# EAGLE design 7-Segment Anzeige (EAGLE 4.15)
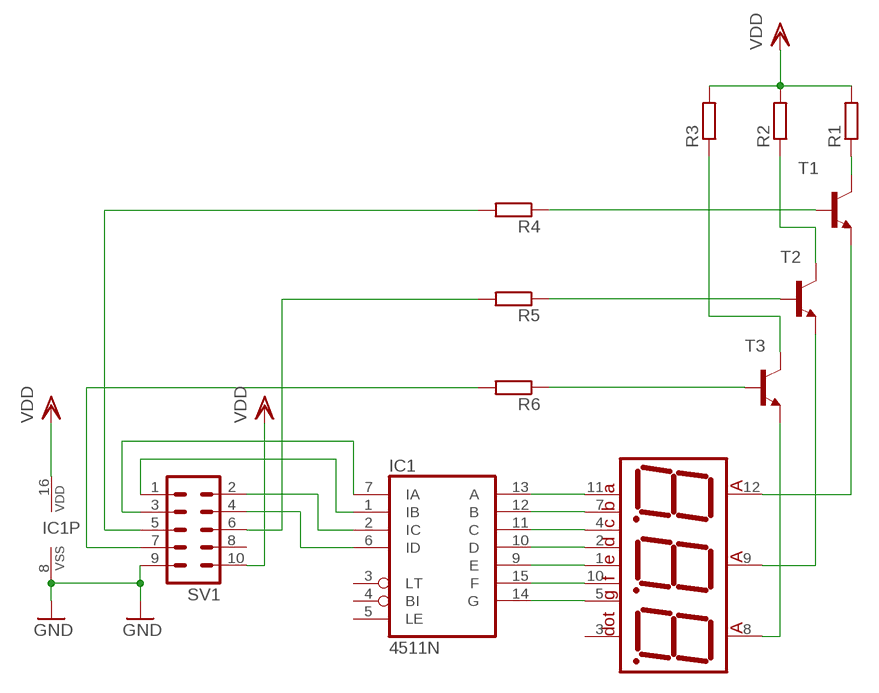
[diagram p0: schematic, sheet 1]

## Parts
IC1  4511N  [DIL16]
R1  R-EU_0309/10  [0309/10]
R2  R-EU_0309/10  [0309/10]
R3  R-EU_0309/10  [0309/10]
R4  R-EU_0309/10  [0309/10]
R5  R-EU_0309/10  [0309/10]
R6  R-EU_0309/10  [0309/10]
SV1  ML10  [ML10]
T1  BC546B-NPN-TO92-EBC  [TO92-EBC]
T2  BC546B-NPN-TO92-EBC  [TO92-EBC]
T3  BC546B-NPN-TO92-EBC  [TO92-EBC]
U$1  7SEG-10X3  [3X7SEG-CA]

## Nets
GND: IC1.8(VSS) SV1.9
N$1: IC1.13(A) U$1.11
N$2: IC1.12(B) U$1.7
N$3: IC1.11(C) U$1.4
N$4: IC1.10(D) U$1.2
N$5: IC1.9(E) U$1.1
N$6: IC1.15(F) U$1.10
N$7: IC1.14(G) U$1.5
N$8: T3.E U$1.8
N$9: IC1.1(IB) SV1.1
N$10: IC1.2(IC) SV1.2
N$11: IC1.7(IA) SV1.3
N$12: IC1.6(ID) SV1.4
N$13: R4.2 SV1.5
N$14: R5.2 SV1.6
N$15: R6.2 SV1.7
N$16: T2.E U$1.9
N$17: T1.E U$1.12
N$18: R1.1 T1.C
N$19: R4.1 T1.B
N$20: R6.1 T3.B
N$21: R5.1 T2.B
N$22: R2.1 T2.C
N$23: R3.1 T3.C
VDD: IC1.16(VDD) R1.2 R2.2 R3.2 SV1.10
Unconnected: IC1.3(LT) IC1.4(BI) IC1.5(LE) SV1.8 U$1.3

## Library data of the parts
IC1 = 45xx:4511: BCD to 7-segment LATCH/DECODER/DRIVER
R1-R6 = rcl:R-EU_: RESISTOR, European symbol
SV1 = con-harting-ml:ML10: HARTING
T1-T3 = transistor:*-NPN-: NPN Transistror
U$1 = Anzeige:7SEG-10X3

## Board
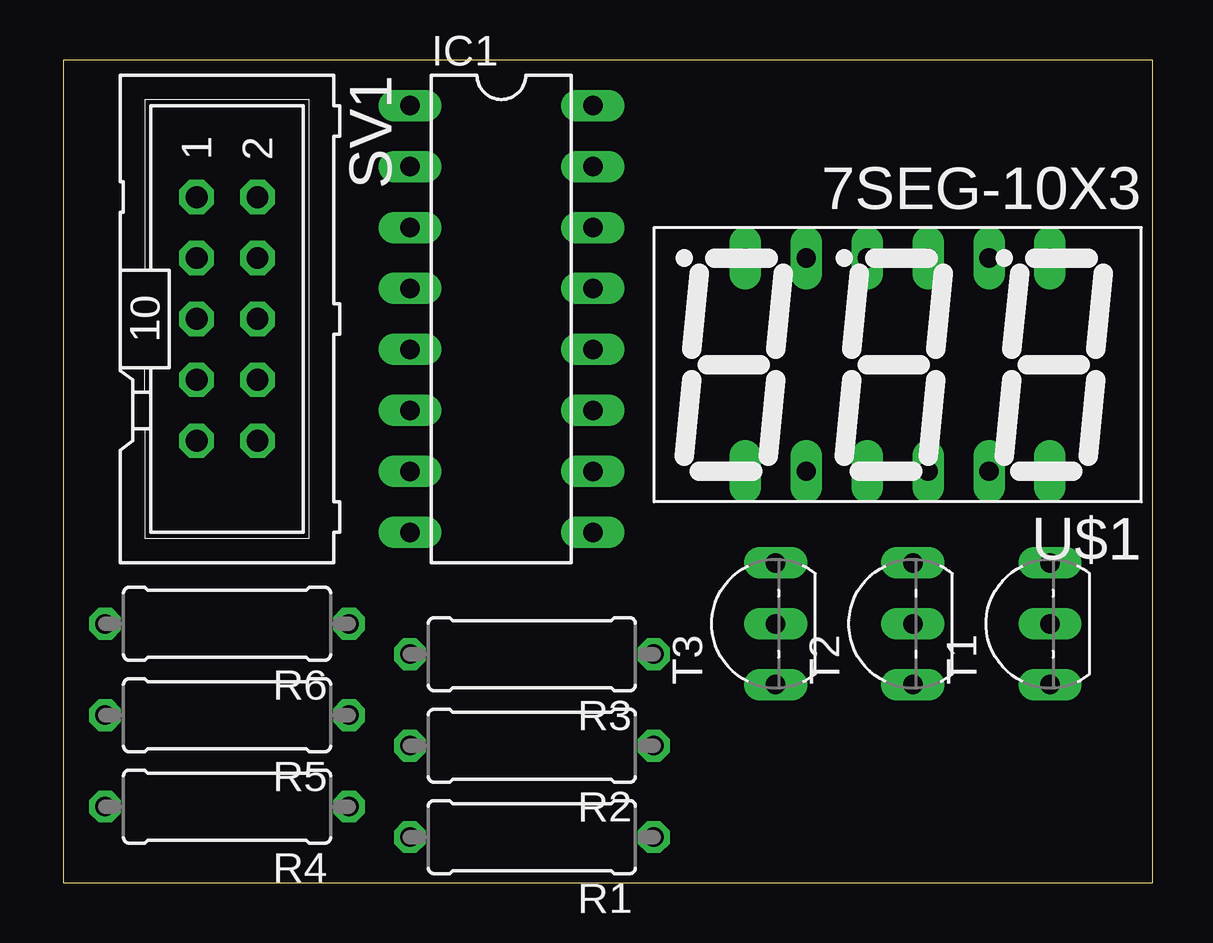
[diagram p1: board, top side]
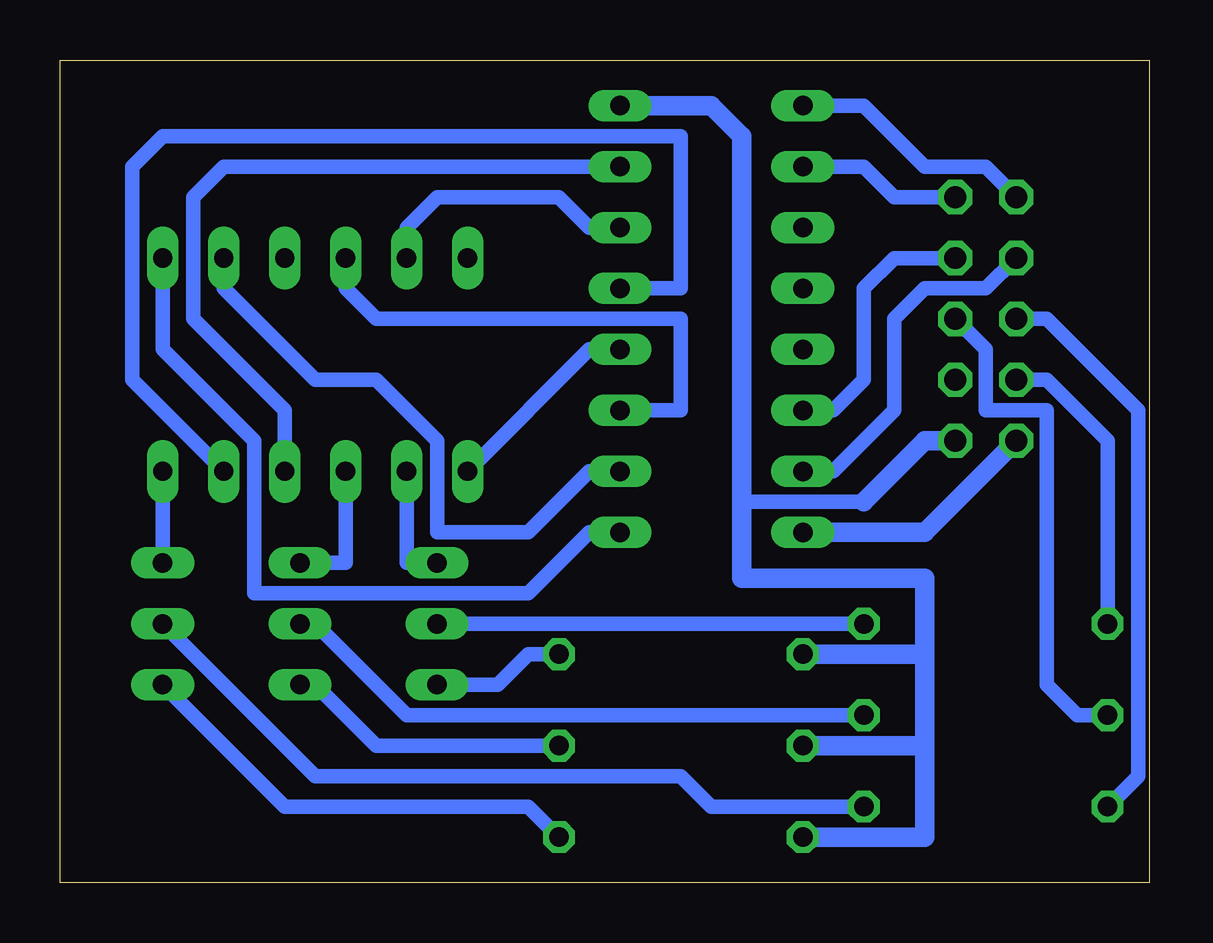
[diagram p2: board, bottom side, seen from below]

Size 45.39 x 34.28 mm. Coordinates in mm from the lower left corner, seen from the top.
Outline: 0,0 45.39,0 45.39,34.28 0,34.28 0,0
Copper layers (1*16): Top 0.035mm / dielectric 1.5mm / Bottom 0.035mm
Design rules "default": minimum track width 16mil, minimum drill 24mil, track to track 8mil, track to pad 8mil, pad to pad 8mil, via to via 8mil, smd to smd 8mil, copper to edge 40mil, drill to drill 8mil, minimum pad ring 10mil, minimum via ring 8mil, stop-mask expansion 4mil, vias tented up to drill 0mil, thermal gap 10mil

### Footprints (pad centres in the part's own frame; a part is rotated, then mirrored left to right if it is on the bottom)
DIL16 = drill 0.813 long: 1 -8.89,-3.81; 2 -6.35,-3.81; 3 -3.81,-3.81; 4 -1.27,-3.81; 5 1.27,-3.81; 6 3.81,-3.81; 7 6.35,-3.81; 8 8.89,-3.81; 9 8.89,3.81; 10 6.35,3.81; 11 3.81,3.81; 12 1.27,3.81; 13 -1.27,3.81; 14 -3.81,3.81; 15 -6.35,3.81; 16 -8.89,3.81
0309/10 = drill 0.813 octagon: 1 -5.08,0; 2 5.08,0
ML10 = drill 0.914 octagon: 1 -5.08,-1.27; 2 -5.08,1.27; 3 -2.54,-1.27; 4 -2.54,1.27; 5 0,-1.27; 6 0,1.27; 7 2.54,-1.27; 8 2.54,1.27; 9 5.08,-1.27; 10 5.08,1.27
TO92-EBC = drill 0.813 long: B 0,-1.27; C -2.54,-1.27; E 2.54,-1.27
3X7SEG-CA = drill 0.8 long: 1 -6.35,-5.08; 2 -3.81,-5.08; 3 -1.27,-5.08; 4 1.27,-5.08; 5 3.81,-5.08; 6 6.35,-5.08; 7 6.35,3.81; 8 3.81,3.81; 9 1.27,3.81; 10 -1.27,3.81; 11 -3.81,3.81; 12 -6.35,3.81

### Placement (x,y rotation side)
IC1  18.25,23.49 270 top
R1  19.52,1.9 180 top
R2  19.52,5.71 180 top
R3  19.52,9.52 180 top
R4  6.82,3.17 180 top
R5  6.82,6.98 180 top
R6  6.82,10.79 180 top
SV1  6.82,23.49 270 top
T1  39.84,10.79 90 top
T2  34.12,10.79 90 top
T3  28.41,10.79 90 top
U$1  34.76,20.95 180 top

### Tracks (layer width: path | path; a pad name or v marks a point on that pad's centre or on a via)
GND
  Bottom 0.813: SV1.9 9.36,14.6 IC1.8
N$1
  Bottom 0.61: U$1.11 42.38,20.95 42.38,29.84 41.11,31.11 19.52,31.11 19.52,24.76 IC1.13
N$2
  Bottom 0.61: IC1.12 23.33,22.22 U$1.7
N$3
  Bottom 0.61: U$1.4 33.49,24.76 32.22,23.49 19.52,23.49 19.52,19.68 IC1.11
N$4
  Bottom 0.61: IC1.10 23.33,17.14 25.87,14.6 29.68,14.6 29.68,18.41 32.22,20.95 34.76,20.95 38.57,24.76 U$1.2
N$5
  Bottom 0.61: IC1.9 23.33,14.6 25.87,12.06 37.3,12.06 37.3,18.41 41.11,22.22 U$1.1
N$6
  Bottom 0.61: U$1.10 36.03,19.68 39.84,23.49 39.84,28.57 38.57,29.84 IC1.15
N$7
  Bottom 0.61: IC1.14 23.33,27.3 24.6,28.57 29.68,28.57 30.95,27.3 U$1.5
N$8
  Bottom 0.61: T3.E 30.95,13.33 U$1.8
N$9
  Bottom 0.61: SV1.1 6.82,29.84 9.36,29.84 11.9,32.38 IC1.1
N$10
  Bottom 0.61: SV1.2 10.63,28.57 11.9,29.84 IC1.2
N$11
  Bottom 0.61: SV1.3 6.82,24.76 9.36,24.76 10.63,23.49 10.63,19.68 13.17,17.14 IC1.7
N$12
  Bottom 0.61: SV1.4 10.63,26.03 11.9,24.76 11.9,20.95 13.17,19.68 IC1.6
N$13
  Bottom 0.61: SV1.5 4.28,23.49 0.47,19.68 0.47,4.44 R4.2
N$14
  Bottom 0.61: SV1.6 6.82,22.22 6.82,19.68 4.28,19.68 4.28,8.25 3.01,6.98 R5.2
N$15
  Bottom 0.61: R6.2 1.74,18.41 4.28,20.95 SV1.7
N$16
  Bottom 0.61: T2.E 33.49,13.33 U$1.9
N$17
  Bottom 0.61: T1.E U$1.12
N$18
  Bottom 0.61: T1.C 36.03,3.17 25.87,3.17 R1.1
N$19
  Bottom 0.61: R4.1 18.25,3.17 19.52,4.44 34.76,4.44 T1.B
N$20
  Bottom 0.61: R6.1 T3.B
N$21
  Bottom 0.61: R5.1 30.95,6.98 34.76,10.79 T2.B
N$22
  Bottom 0.61: T2.C 34.76,8.25 32.22,5.71 R2.1
N$23
  Bottom 0.61: R3.1 25.87,9.52 27.14,8.25 T3.C
VDD
  Bottom 0.61: 11.9,15.87 16.98,15.87
  Bottom 0.813: 9.36,9.52 R3.2 | 9.36,5.71 R2.2 | 9.36,5.71 9.36,9.52 | R1.2 9.36,1.9 9.36,5.71 | IC1.16 18.25,32.38 16.98,31.11 16.98,15.87 16.98,12.7 9.36,12.7 9.36,9.52 | SV1.10 9.36,18.41 11.9,15.87